# EAGLE board STBlitter_RevC2 (EAGLE 9.4.2)
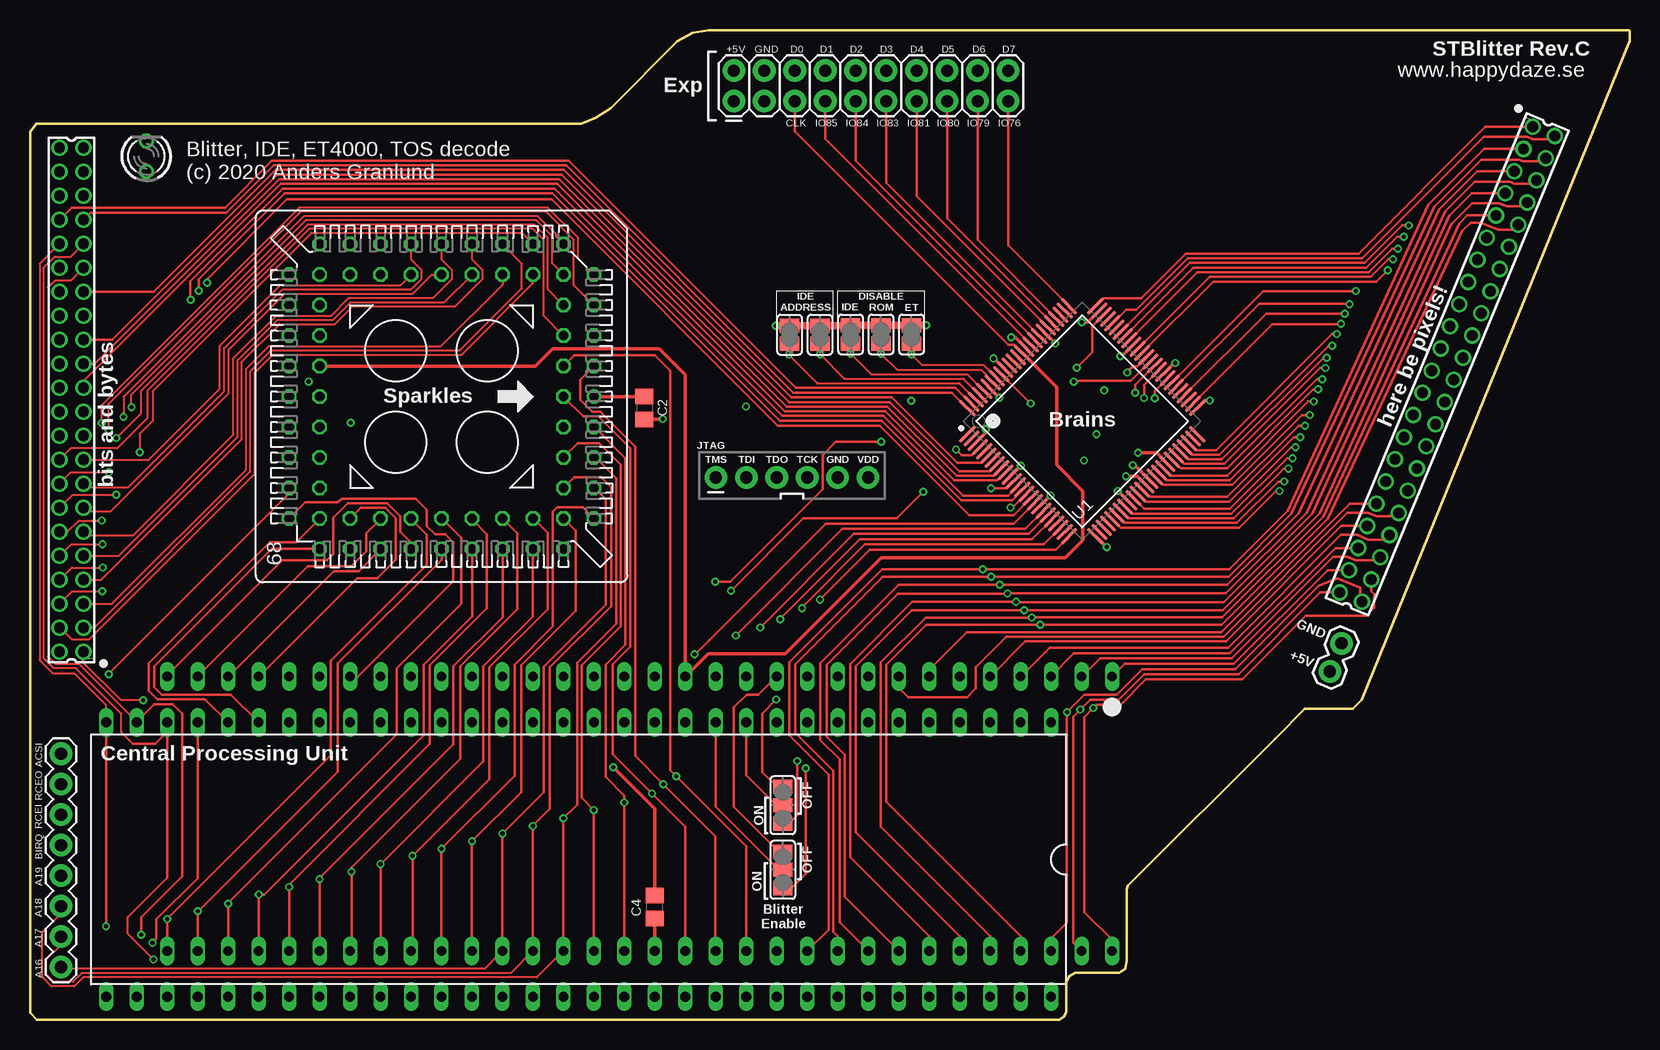
[diagram p2: board, top side]
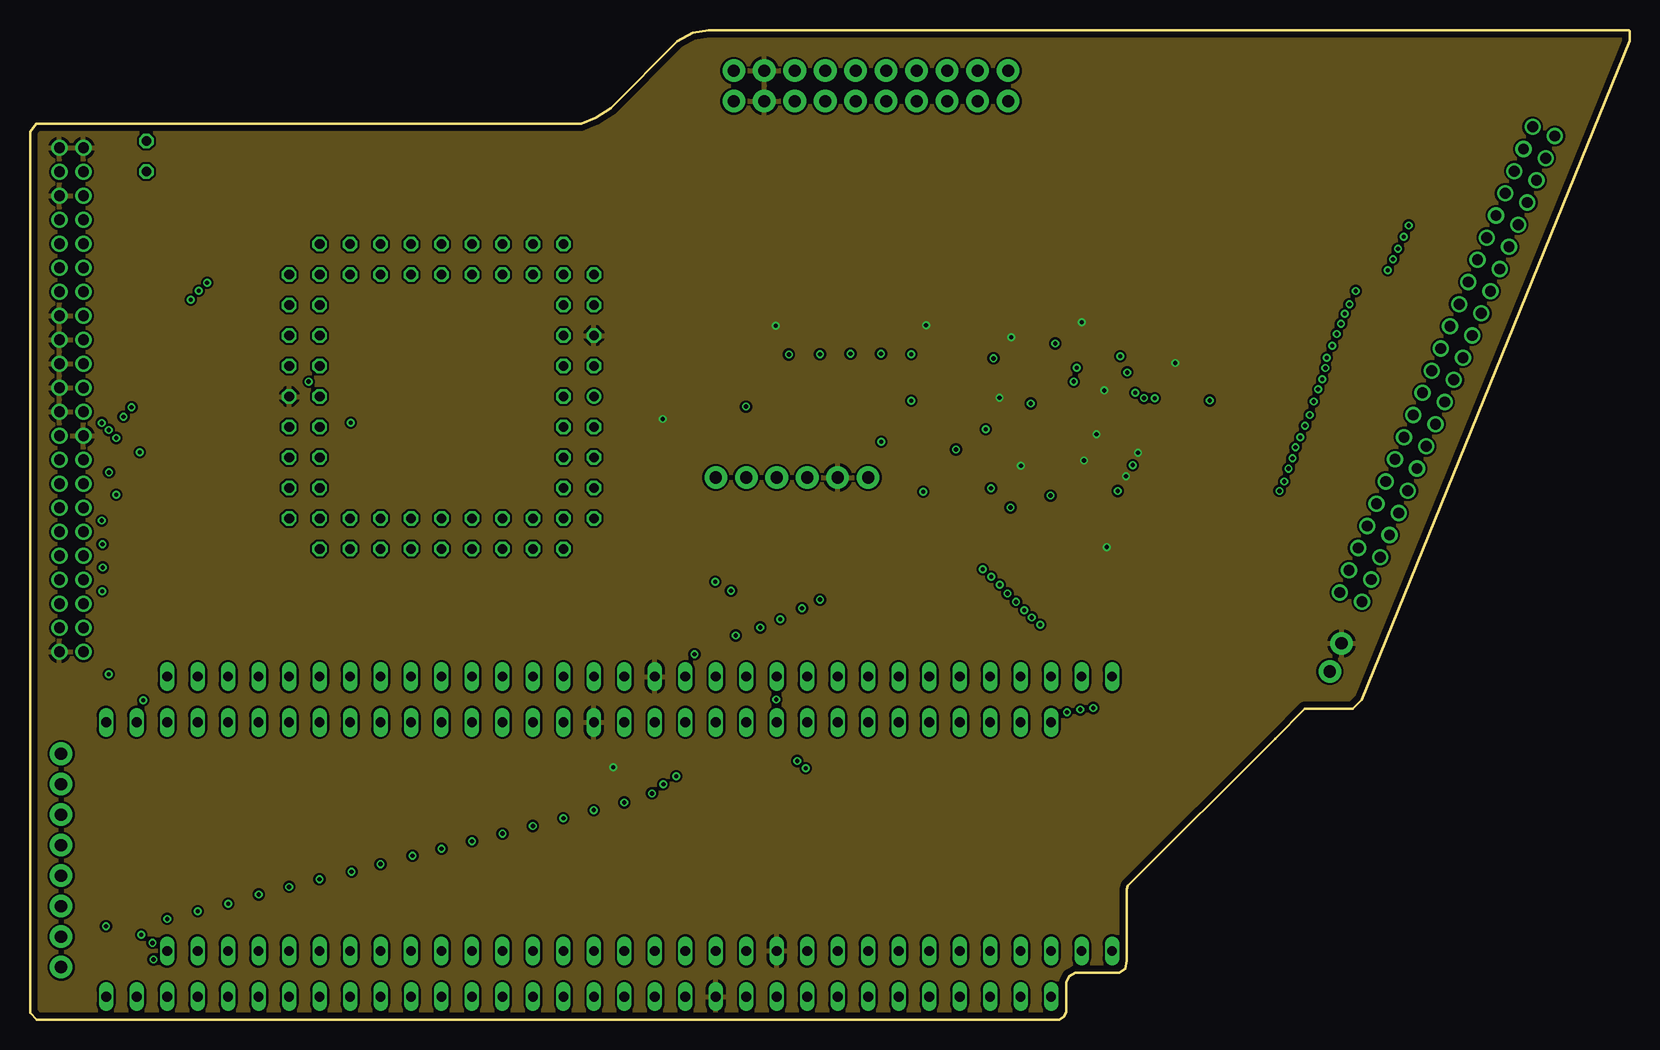
[diagram p3: board, inner layer Route2]
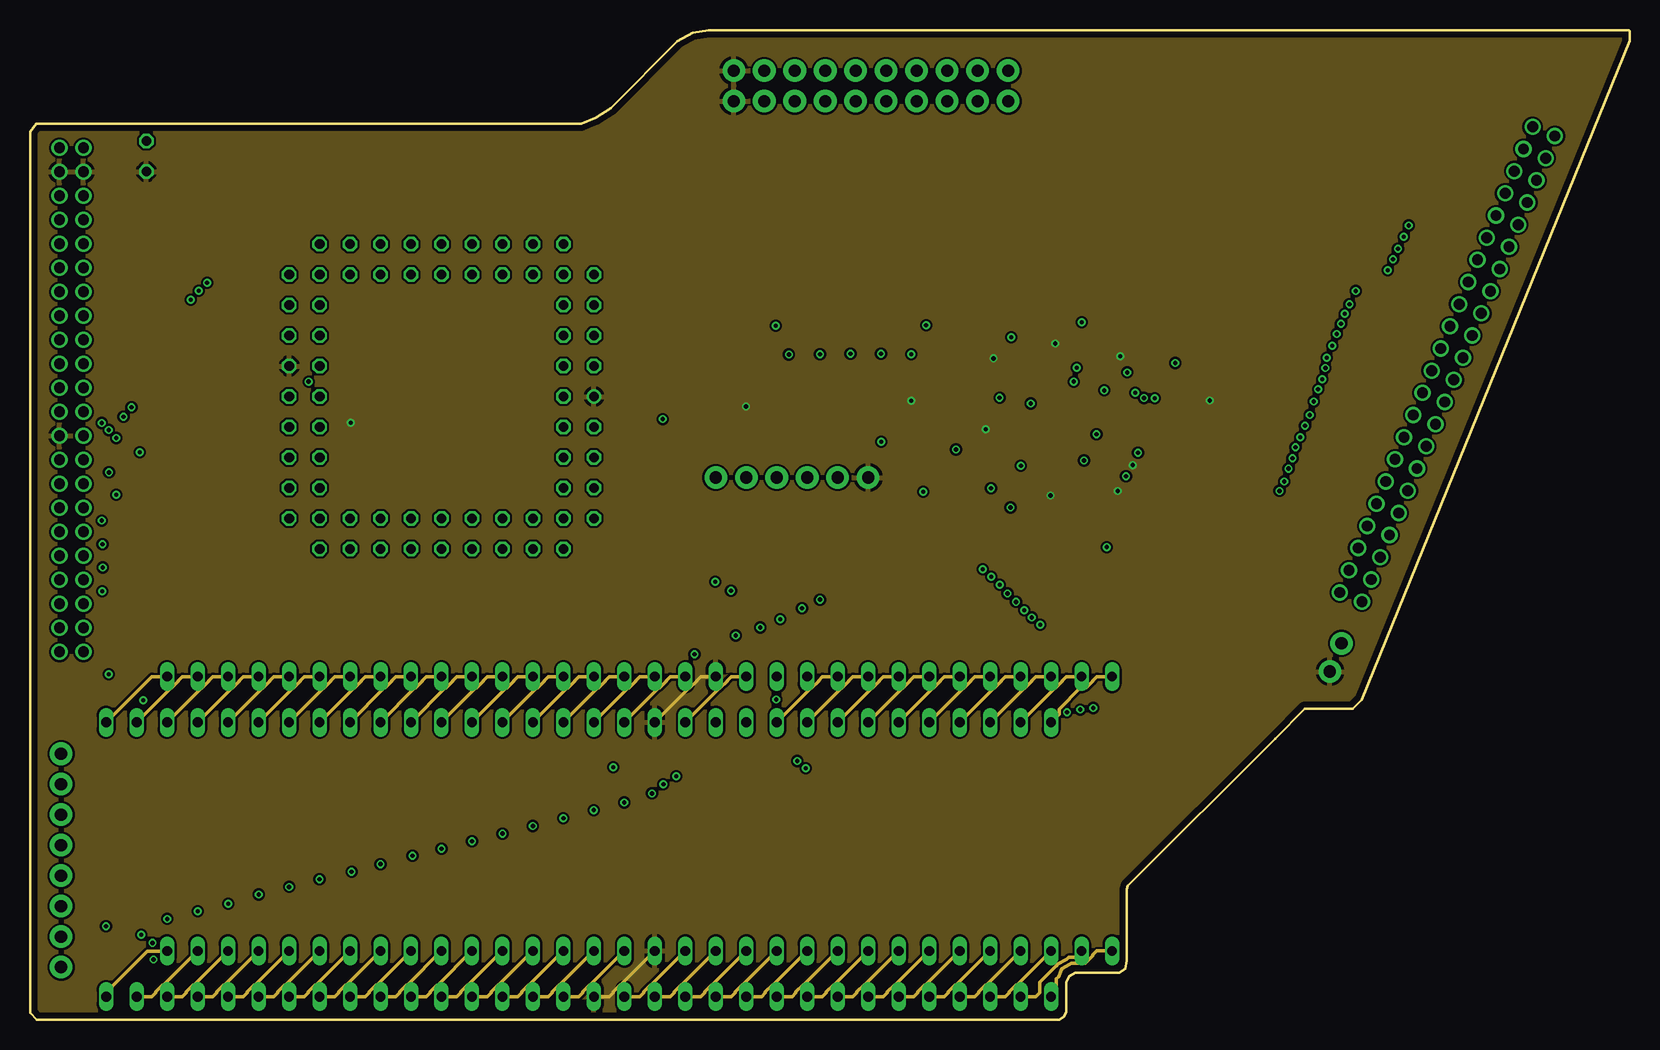
[diagram p4: board, inner layer Route15]
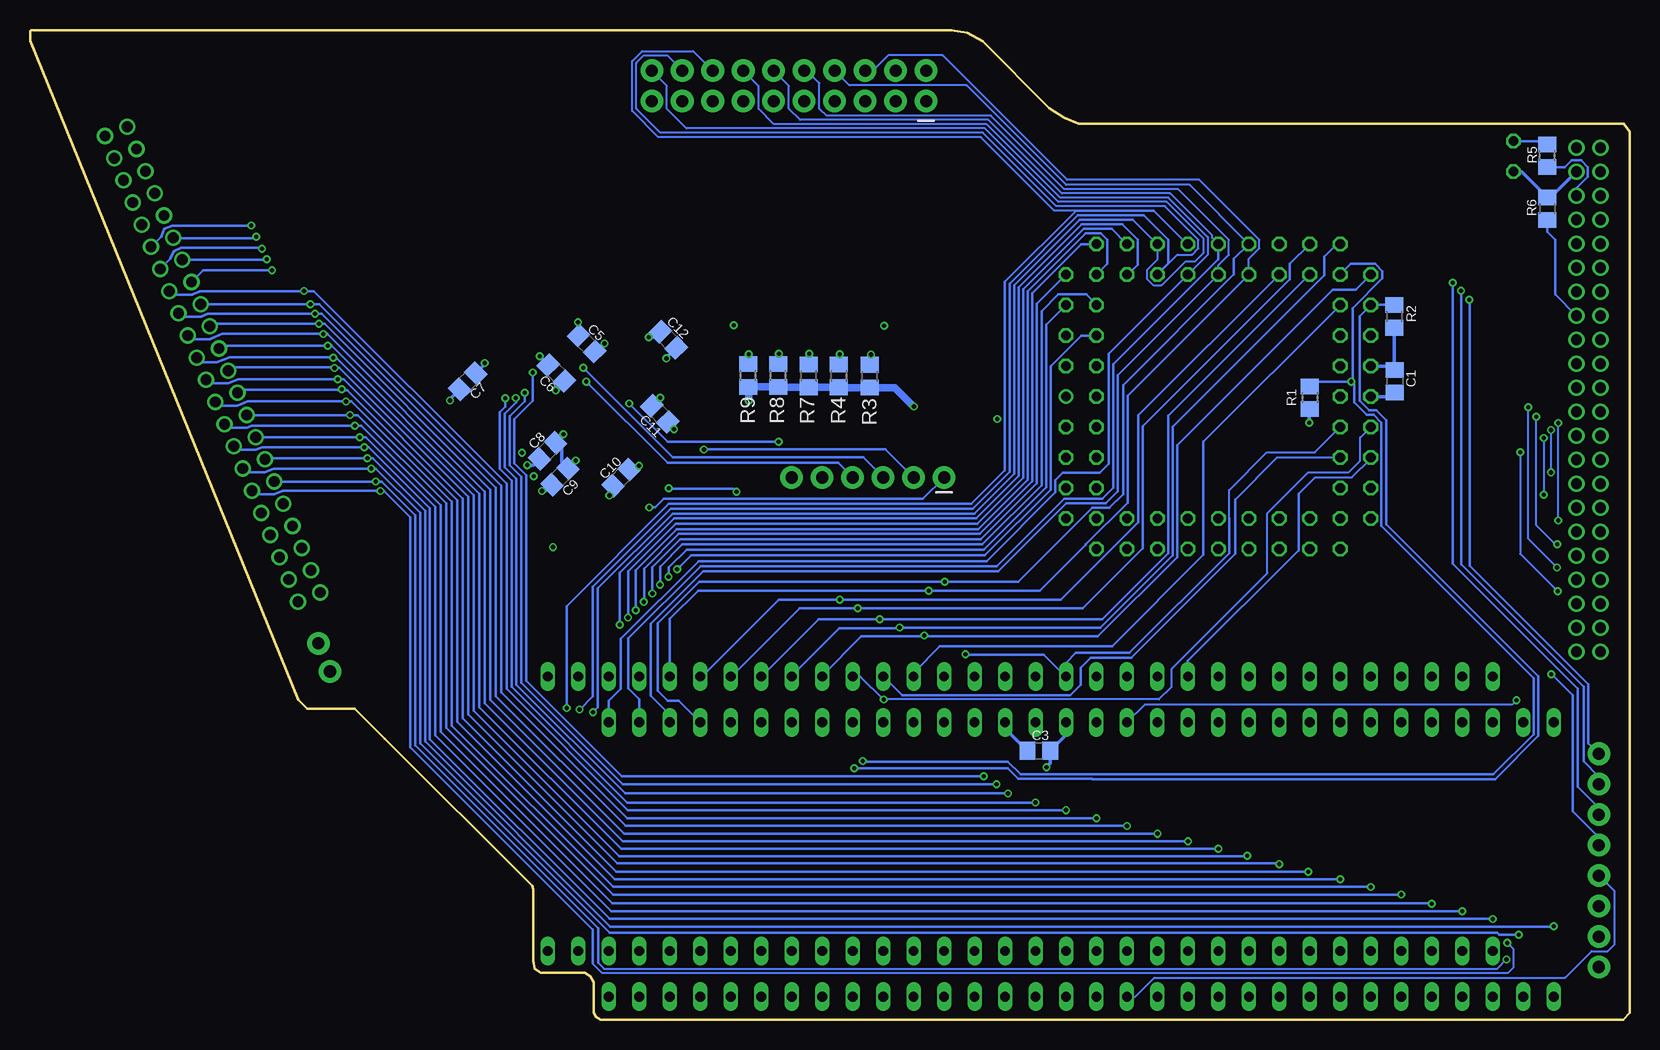
[diagram p5: board, bottom side, seen from below]

Size 133.32 x 82.46 mm. Coordinates in mm from the lower left corner, seen from the top.
Outline: 133.32,81.56 133.32,82.35 133.21,82.46 56.57,82.46 55.24,82.22 53.95,81.54 48.39,75.93 47.15,75.13 45.93,74.63 0.52,74.63 0,73.96 0,0.56 0.56,0 85.75,0 86.16,0.23 86.36,0.59 86.36,3.11 86.62,3.61 87.09,3.89 90.78,3.89 91.28,4.25 91.39,4.89 91.39,10.87 91.49,11.14 103.77,23.41 106.24,25.88 110.24,25.88 110.97,26.63 133.32,81.56
Copper layers (1*2*15*16): Top 0.035mm / dielectric 0.2mm / Route2 0.035mm / dielectric 1.2mm / Route15 0.035mm / dielectric 0.2mm / Bottom 0.035mm
Design rules "Elecrow_4-layer_PCB_eagle_rule *": minimum track width 6mil, minimum drill 12mil, track to track 7mil, track to pad 7mil, pad to pad 7mil, via to via 7mil, smd to smd 0mil, copper to edge 20mil, drill to drill 10mil, minimum pad ring 6mil, minimum via ring 6mil, stop-mask expansion 0mil, vias tented up to drill 100mil, thermal gap 10mil
Net classes: 0 default: width 0.178 mm; 1 PWR: width 0.305 mm; 2 GND: width 0.305 mm

## Footprints (pad centres in the part's own frame; a part is rotated, then mirrored left to right if it is on the bottom)
DIL64 = drill 0.813 long: 1 -39.37,-11.43; 2 -36.83,-11.43; 3 -34.29,-11.43; 4 -31.75,-11.43; 5 -29.21,-11.43; 6 -26.67,-11.43; 7 -24.13,-11.43; 8 -21.59,-11.43; 9 -19.05,-11.43; 10 -16.51,-11.43; 11 -13.97,-11.43; 12 -11.43,-11.43; 13 -8.89,-11.43; 14 -6.35,-11.43; 15 -3.81,-11.43; 16 -1.27,-11.43; 17 1.27,-11.43; 18 3.81,-11.43; 19 6.35,-11.43; 20 8.89,-11.43; 21 11.43,-11.43; 22 13.97,-11.43; 23 16.51,-11.43; 24 19.05,-11.43; 25 21.59,-11.43; 26 24.13,-11.43; 27 26.67,-11.43; 28 29.21,-11.43; 29 31.75,-11.43; 30 34.29,-11.43; 31 36.83,-11.43; 32 39.37,-11.43; 33 39.37,11.43; 34 36.83,11.43; 35 34.29,11.43; 36 31.75,11.43; 37 29.21,11.43; 38 26.67,11.43; 39 24.13,11.43; 40 21.59,11.43; 41 19.05,11.43; 42 16.51,11.43; 43 13.97,11.43; 44 11.43,11.43; 45 8.89,11.43; 46 6.35,11.43; 47 3.81,11.43; 48 1.27,11.43; 49 -1.27,11.43; 50 -3.81,11.43; 51 -6.35,11.43; 52 -8.89,11.43; 53 -11.43,11.43; 54 -13.97,11.43; 55 -16.51,11.43; 56 -19.05,11.43; 57 -21.59,11.43; 58 -24.13,11.43; 59 -26.67,11.43; 60 -29.21,11.43; 61 -31.75,11.43; 62 -34.29,11.43; 63 -36.83,11.43; 64 -39.37,11.43
PLCC68-S = drill 0.813: 1 0,12.7 | drill 0.813 octagon: 2 0,10.16; 3 -2.54,12.7; 4 -2.54,10.16; 5 -5.08,12.7; 6 -5.08,10.16; 7 -7.62,12.7; 8 -7.62,10.16; 9 -10.16,12.7; 10 -12.7,10.16; 11 -10.16,10.16; 12 -12.7,7.62; 13 -10.16,7.62; 14 -12.7,5.08; 15 -10.16,5.08; 16 -12.7,2.54; 17 -10.16,2.54; 18 -12.7,0; 19 -10.16,0; 20 -12.7,-2.54; 21 -10.16,-2.54; 22 -12.7,-5.08; 23 -10.16,-5.08; 24 -12.7,-7.62; 25 -10.16,-7.62; 26 -12.7,-10.16; 27 -10.16,-12.7; 28 -10.16,-10.16; 29 -7.62,-12.7; 30 -7.62,-10.16; 31 -5.08,-12.7; 32 -5.08,-10.16; 33 -2.54,-12.7; 34 -2.54,-10.16; 35 0,-12.7; 36 0,-10.16; 37 2.54,-12.7; 38 2.54,-10.16; 39 5.08,-12.7; 40 5.08,-10.16; 41 7.62,-12.7; 42 7.62,-10.16; 43 10.16,-12.7; 44 12.7,-10.16; 45 10.16,-10.16; 46 12.7,-7.62; 47 10.16,-7.62; 48 12.7,-5.08; 49 10.16,-5.08; 50 12.7,-2.54; 51 10.16,-2.54; 52 12.7,0; 53 10.16,0; 54 12.7,2.54; 55 10.16,2.54; 56 12.7,5.08; 57 10.16,5.08; 58 12.7,7.62; 59 10.16,7.62; 60 12.7,10.16; 61 10.16,12.7; 62 10.16,10.16; 63 7.62,12.7; 64 7.62,10.16; 65 5.08,12.7; 66 5.08,10.16; 67 2.54,12.7; 68 2.54,10.16
C0805 = smd 1.3 x 1.5: 1 -0.95,0; 2 0.95,0
IDE44_CON = drill 0.9 pad 1.27: 1 -21,-1; 2 -21,1; 3 -19,-1; 4 -19,1; 5 -17,-1; 6 -17,1; 7 -15,-1; 8 -15,1; 9 -13,-1; 10 -13,1; 11 -11,-1; 12 -11,1; 13 -9,-1; 14 -9,1; 15 -7,-1; 16 -7,1; 17 -5,-1; 18 -5,1; 19 -3,-1; 20 -3,1; 21 -1,-1; 22 -1,1; 23 1,-1; 24 1,1; 25 3,-1; 26 3,1; 27 5,-1; 28 5,1; 29 7,-1; 30 7,1; 31 9,-1; 32 9,1; 33 11,-1; 34 11,1; 35 13,-1; 36 13,1; 37 15,-1; 38 15,1; 39 17,-1; 40 17,1; 41 19,-1; 42 19,1; 43 21,-1; 44 21,1
DIL64_SOCKET = drill 0.813 long: 1 -39.37,-11.43; 2 -36.83,-11.43; 3 -34.29,-11.43; 4 -31.75,-11.43; 5 -29.21,-11.43; 6 -26.67,-11.43; 7 -24.13,-11.43; 8 -21.59,-11.43; 9 -19.05,-11.43; 10 -16.51,-11.43; 11 -13.97,-11.43; 12 -11.43,-11.43; 13 -8.89,-11.43; 14 -6.35,-11.43; 15 -3.81,-11.43; 16 -1.27,-11.43; 17 1.27,-11.43; 18 3.81,-11.43; 19 6.35,-11.43; 20 8.89,-11.43; 21 11.43,-11.43; 22 13.97,-11.43; 23 16.51,-11.43; 24 19.05,-11.43; 25 21.59,-11.43; 26 24.13,-11.43; 27 26.67,-11.43; 28 29.21,-11.43; 29 31.75,-11.43; 30 34.29,-11.43; 31 36.83,-11.43; 32 39.37,-11.43; 33 39.37,11.43; 34 36.83,11.43; 35 34.29,11.43; 36 31.75,11.43; 37 29.21,11.43; 38 26.67,11.43; 39 24.13,11.43; 40 21.59,11.43; 41 19.05,11.43; 42 16.51,11.43; 43 13.97,11.43; 44 11.43,11.43; 45 8.89,11.43; 46 6.35,11.43; 47 3.81,11.43; 48 1.27,11.43; 49 -1.27,11.43; 50 -3.81,11.43; 51 -6.35,11.43; 52 -8.89,11.43; 53 -11.43,11.43; 54 -13.97,11.43; 55 -16.51,11.43; 56 -19.05,11.43; 57 -21.59,11.43; 58 -24.13,11.43; 59 -26.67,11.43; 60 -29.21,11.43; 61 -31.75,11.43; 62 -34.29,11.43; 63 -36.83,11.43; 64 -39.37,11.43
1X08 = drill 1.016 pad 1.88: 1 0,0; 2 2.54,0; 3 5.08,0; 4 7.62,0; 5 10.16,0; 6 12.7,0; 7 15.24,0; 8 17.78,0
2X10 = drill 1.016 pad 1.88: 1 0,0; 2 0,2.54; 3 2.54,0; 4 2.54,2.54; 5 5.08,0; 6 5.08,2.54; 7 7.62,0; 8 7.62,2.54; 9 10.16,0; 10 10.16,2.54; 11 12.7,0; 12 12.7,2.54; 13 15.24,0; 14 15.24,2.54; 15 17.78,0; 16 17.78,2.54; 17 20.32,0; 18 20.32,2.54; 19 22.86,0; 20 22.86,2.54
JTAG_ATDH2 = drill 1.016 pad 1.88: 1 -1.27,5.08; 2 -1.27,2.54; 3 -1.27,0; 4 -1.27,-2.54; 5 -1.27,-5.08; 6 -1.27,-7.62
LED3MM = drill 0.813 octagon: A -1.27,0; K 1.27,0
1X02 = drill 1.016 pad 1.88: 1 0,0; 2 2.54,0
R0805 = smd 1.3 x 1.5: 1 -0.95,0; 2 0.95,0
SJ_2 = smd 1.168 x 1.6: 1 -1.524,0; 2 0,0; 3 1.524,0
SJ = smd 1.168 x 1.6: 1 -0.762,0; 2 0.762,0
STGACON = drill 0.9 pad 1.27: 1 -21,-1; 2 -21,1; 3 -19,-1; 4 -19,1; 5 -17,-1; 6 -17,1; 7 -15,-1; 8 -15,1; 9 -13,-1; 10 -13,1; 11 -11,-1; 12 -11,1; 13 -9,-1; 14 -9,1; 15 -7,-1; 16 -7,1; 17 -5,-1; 18 -5,1; 19 -3,-1; 20 -3,1; 21 -1,-1; 22 -1,1; 23 1,-1; 24 1,1; 25 3,-1; 26 3,1; 27 5,-1; 28 5,1; 29 7,-1; 30 7,1; 31 9,-1; 32 9,1; 33 11,-1; 34 11,1; 35 13,-1; 36 13,1; 37 15,-1; 38 15,1; 39 17,-1; 40 17,1; 41 19,-1; 42 19,1; 43 21,-1; 44 21,1
MICROCHIP_-_ATMEL_ATF1504ASV-15AC100_1 = smd 1.8 x 0.3: 1 -7.55,6; 2 -7.55,5.5; 3 -7.55,5; 4 -7.55,4.5; 5 -7.55,4; 6 -7.55,3.5; 7 -7.55,3; 8 -7.55,2.5; 9 -7.55,2; 10 -7.55,1.5; 11 -7.55,1; 12 -7.55,0.5; 13 -7.55,0; 14 -7.55,-0.5; 15 -7.55,-1; 16 -7.55,-1.5; 17 -7.55,-2; 18 -7.55,-2.5; 19 -7.55,-3; 20 -7.55,-3.5; 21 -7.55,-4; 22 -7.55,-4.5; 23 -7.55,-5; 24 -7.55,-5.5; 25 -7.55,-6; 51 7.55,-6; 52 7.55,-5.5; 53 7.55,-5; 54 7.55,-4.5; 55 7.55,-4; 56 7.55,-3.5; 57 7.55,-3; 58 7.55,-2.5; 59 7.55,-2; 60 7.55,-1.5; 61 7.55,-1; 62 7.55,-0.5; 63 7.55,0; 64 7.55,0.5; 65 7.55,1; 66 7.55,1.5; 67 7.55,2; 68 7.55,2.5; 69 7.55,3; 70 7.55,3.5; 71 7.55,4; 72 7.55,4.5; 73 7.55,5; 74 7.55,5.5; 75 7.55,6 | smd 0.3 x 1.8: 26 -6,-7.55; 27 -5.5,-7.55; 28 -5,-7.55; 29 -4.5,-7.55; 30 -4,-7.55; 31 -3.5,-7.55; 32 -3,-7.55; 33 -2.5,-7.55; 34 -2,-7.55; 35 -1.5,-7.55; 36 -1,-7.55; 37 -0.5,-7.55; 38 0,-7.55; 39 0.5,-7.55; 40 1,-7.55; 41 1.5,-7.55; 42 2,-7.55; 43 2.5,-7.55; 44 3,-7.55; 45 3.5,-7.55; 46 4,-7.55; 47 4.5,-7.55; 48 5,-7.55; 49 5.5,-7.55; 50 6,-7.55; 76 6,7.55; 77 5.5,7.55; 78 5,7.55; 79 4.5,7.55; 80 4,7.55; 81 3.5,7.55; 82 3,7.55; 83 2.5,7.55; 84 2,7.55; 85 1.5,7.55; 86 1,7.55; 87 0.5,7.55; 88 0,7.55; 89 -0.5,7.55; 90 -1,7.55; 91 -1.5,7.55; 92 -2,7.55; 93 -2.5,7.55; 94 -3,7.55; 95 -3.5,7.55; 96 -4,7.55; 97 -4.5,7.55; 98 -5,7.55; 99 -5.5,7.55; 100 -6,7.55

## Placement (x,y rotation side)
68000  [DIL64]  45.72,13.34 180 top
BLITTER  STBLITTER  [PLCC68-S]  34.3,51.92 270 top
C1  0.1uF  [C0805]  19.61,53.19 270 bottom
C2  0.1uF  [C0805]  51.21,50.95 270 top
C3  0.1uF  [C0805]  49.25,22.4 0 bottom
C4  0.1uF  [C0805]  52.07,9.37 90 top
C5  0.1uF  [C0805]  86.94,56.34 315 bottom
C6  0.1uF  [C0805]  89.46,53.87 135 bottom
C7  0.1uF  [C0805]  96.85,53.19 225 bottom
C8  0.1uF  [C0805]  90.2,47.4 225 bottom
C9  0.1uF  [C0805]  89.15,45.24 225 bottom
C10  0.1uF  [C0805]  84.07,45.16 225 bottom
C11  0.1uF  [C0805]  80.85,50.47 315 bottom
C12  0.1uF  [C0805]  80.14,56.64 315 bottom
CFCARD  IDE44_CON  [IDE44_CON]  3.45,51.64 90 top
IC1  [DIL64_SOCKET]  50.8,17.14 180 top
J1  [1X08]  2.59,4.37 90 top
J4  [2X10]  58.65,76.53 0 top
JTAG  JTAG_ATDH2  [JTAG_ATDH2]  62.23,46.43 90 top
LED1  [LED3MM]  9.7,71.93 90 top
PWR  [1X02]  109.3,31.34 247.5 top
R1  [R0805]  26.67,51.82 270 bottom
R2  [R0805]  19.63,58.6 270 bottom
R3  [R0805]  63.35,53.61 90 bottom
R4  [R0805]  65.91,53.64 90 bottom
R5  390R  [R0805]  6.88,71.98 90 bottom
R6  100R  [R0805]  6.88,67.56 270 bottom
R7  [R0805]  68.43,53.64 90 bottom
R8  [R0805]  70.97,53.66 90 bottom
R9  [R0805]  73.48,53.66 90 bottom
SJ1  [SJ_2]  62.74,17.86 90 top
SJ2  [SJ_2]  62.74,12.47 90 top
SJ3  [SJ]  63.29,57.06 270 top
SJ4  [SJ]  65.84,57.06 270 top
SJ5  [SJ]  68.38,57.09 270 top
SJ6  [SJ]  70.92,57.09 270 top
SJ7  [SJ]  73.45,57.09 270 top
STGA  STGA  [STGACON]  118.11,54.61 247.5 top
U1  ATF1504_SMD100MICROCHIP_-_ATMEL_ATF1504ASV-15AC100_0_1  [MICROCHIP_-_ATMEL_ATF1504ASV-15AC100_1]  87.68,49.86 45 top

## Tracks (layer width: path | path; a pad name or v marks a point on that pad's centre or on a via)
+5V  (via drill 0.35)
  Top 0.305: IC1.49 C4.1 | U1.91 80.33,55.09 v80.29,55.09 | U1.3 79.65,48.91 v79.65,49.2 | U1.18 85.02,43.66 v85.04,43.66 | U1.34 91.59,43.11 v90.65,44.04 | v91.9,46.2 92.05,46.2 U1.39 | U1.51 97.89,51.59 v98.32,51.59 | U1.82 v85.45,56.34 | U1.66 90.97,55.27 v90.86,55.27 | BLITTER.1 C2.1
  Route15 0.305: 68000.49 48.26,1.91 48.59,2.24 48.59,2.29 49.14,2.84 49.2,2.84 IC1.49 | IC1.14 55.88,28.57 55.55,28.25 55.55,28.19 55,27.64 54.94,27.64 68000.14
  Bottom 0.305: C3.1 52.04,24.25 52.04,24.79 68000.14 | CFCARD.41 6.58,68.51 R6.1 9.03,70.66 LED1.A | C5.2 86.12,55.66 v85.45,56.34 | C7.2 98.32,51.71 v98.32,51.59 | v91.9,46.2 91.39,46.2 C8.2 | v90.65,44.04 90.35,44.04 C9.2 | v85.04,43.66 85.04,44.2 C10.2 | v80.29,55.09 80.29,55.15 C12.2 | v79.65,49.2 80.18,49.72 C11.2 | v90.86,55.27 | v90.86,55.27 C6.2 | BLITTER.33 19.93,54.46 C1.1 19.63,54.16 R2.2 | R1.2 26.72,50.91 v26.72,49.73
  Bottom 0.61: v73.43,51.56 73.43,52.66 R9.1 R8.1 70.94,52.69 R7.1 R4.1 65.89,52.66 R3.1 61.24,52.66 v59.66,51.08
  pour Route15: -13.77,86.46 143.81,86.46 143.81,-9.25 -13.77,-9.25
_BGACK  (via drill 0.35)
  Top 0.203: v64.64,20.93 64.64,12.14 63.45,10.95 SJ2.1
  Bottom 0.203: v64.64,20.93 51.85,20.93 50.96,20.04 44.81,20.04 11.21,20.04 7.62,23.63 7.62,28.61 20.3,41.28 20.3,49.95 21.12,50.77 21.74,50.77 22.51,51.55 22.51,58.62 BLITTER.29 21.59,59.55 R2.1
A1  (via drill 0.35)
  Top 0.178: 10.54,6.82 10.54,6.72 v10.21,6.39
  Top 0.203: v104.12,44.05 103.85,44.05 100.78,40.98 90.91,40.98 U1.30 | IC1.29 27.25,36.78 28.93,36.78 30.48,38.33 30.48,41.78 29.62,42.65 27.57,42.65 BLITTER.47 | 68000.29 13.97,11.78 10.54,8.35 10.54,6.82
  Route15 0.305: IC1.29 17.78,28.57 17.45,28.25 17.45,28.19 16.9,27.64 16.84,27.64 68000.29
  Bottom 0.178: 86.44,4.73 86.44,4.67 85.64,3.87 10.16,3.87 9.69,4.34 9.69,5.86 v10.21,6.39
  Bottom 0.203: 104.11,44.06 112.26,44.06 112.98,43.77 114.53,43.77 STGA.34 | 86.44,4.73 86.44,7.5 101.62,22.69 101.62,41.86 103.83,44.06 104.11,44.06 | 104.11,44.06 v104.12,44.05
A2  (via drill 0.35)
  Top 0.178: 8.27,23.28 7.61,23.95 7.61,25.49 3.82,29.27 1.98,29.27 1.16,30.1 1.16,62.67 2.06,63.58 3.4,63.58 CFCARD.35 | v10.29,5 8.13,7.16 8.13,8.5
  Top 0.203: v104.52,44.83 104.01,44.83 100.57,41.39 91.21,41.39 U1.31 | 8.13,8.5 11.43,11.81 68000.30 11.43,23.98 10.44,22.99 8.56,22.99 8.27,23.28 | IC1.30 25.3,37.36 27.38,37.36 29.17,39.15 29.17,39.17 BLITTER.48
  Route15 0.305: IC1.30 15.24,28.57 14.91,28.25 14.91,28.19 14.36,27.64 14.3,27.64 68000.30
  Bottom 0.178: 85.98,4.73 85.48,4.23 11.07,4.23 v10.29,5
  Bottom 0.203: 85.98,4.73 85.98,7.62 101.22,22.86 101.22,42.04 104.01,44.83 v104.52,44.83 STGA.33
A3  (via drill 0.35)
  Top 0.178: CFCARD.33 3.4,61.58 2.06,61.58 1.65,61.16 1.55,61.16 1.55,61.06 1.51,61.03 1.51,30.25 2.13,29.63 4.07,29.63 8.89,24.81 68000.31
  Top 0.203: v104.88,45.91 104.47,45.91 100.32,41.77 91.53,41.77 U1.32 | IC1.31 13.97,28.6 23.14,37.77 26.77,37.77 28.02,39.01 28.02,40.51 29.22,41.71 BLITTER.49 | v9.27,7.07 9.27,8.5 12.7,11.93 12.7,25.48 11.91,26.26 10.34,26.26 8.89,24.81
  Route15 0.305: IC1.31 12.7,28.57 12.37,28.25 12.37,28.19 11.82,27.64 11.76,27.64 68000.31
  Bottom 0.203: v9.27,7.07 10.88,7.07 11.05,7.24 85.03,7.24 100.81,23.02 100.81,42.22 104.51,45.91 v104.88,45.91 113.03,45.91 113.74,45.62 115.3,45.62 STGA.32
A4  (via drill 0.35)
  Top 0.178: CFCARD.36 0.8,62.99 0.8,29.95 1.93,28.83 3.71,28.83 6.35,26.19 68000.32
  Top 0.203: v105.21,46.78 104.75,46.78 100.12,42.15 91.86,42.15 U1.33 | 68000.32 6.35,7.78 v6.34,7.77 | IC1.32 11.43,28.68 21.03,38.28 24.74,38.28 25.25,38.79 25.25,41.8 26.49,43.03 29.77,43.03 30.86,41.94 30.86,40.64 31.76,39.74 BLITTER.50
  Route15 0.305: 68000.32 10.16,28.57 IC1.32
  Bottom 0.203: v6.34,7.77 6.36,7.75 18.17,7.75 18.18,7.75 84.96,7.75 100.41,23.19 100.41,42.42 104.77,46.78 v105.21,46.78 113.64,46.78 STGA.31
A5  (via drill 0.35)
  Top 0.203: IC1.33 v11.43,8.38 25.07,22.02 25.07,29.9 33.08,37.9 33.08,40.39 31.76,41.71 BLITTER.51 | v105.46,47.69 105.09,47.69 99.98,42.57 92.85,42.57 U1.35
  Route15 0.305: 68000.33 6.35,2.26 9.78,5.69 11.41,5.69 IC1.33
  Bottom 0.203: STGA.30 116.06,47.47 114.51,47.47 113.97,47.69 v105.46,47.69 105.09,47.69 100,42.6 100,23.36 85.02,8.38 v11.43,8.38
A6  (via drill 0.35)
  Top 0.203: IC1.34 v13.97,9.02 14.01,9.02 25.65,20.66 25.65,29.68 34.3,38.32 BLITTER.52 | v105.84,48.53 105.32,48.53 99.92,43.13 93,43.13 U1.36
  Route15 0.305: 68000.34 10.16,1.91 10.49,2.24 10.49,2.29 11.04,2.84 11.1,2.84 IC1.34
  Bottom 0.203: v13.97,9.02 84.88,9.02 99.54,23.68 99.54,42.73 105.34,48.53 v105.84,48.53 STGA.29
A7  (via drill 0.35)
  Top 0.203: IC1.35 v16.51,9.65 16.51,9.72 30.55,23.76 30.55,29.26 35.92,34.63 35.92,40.15 BLITTER.53 | v106.25,49.48 105.71,49.48 99.79,43.56 93.3,43.56 92.69,44.17 U1.37
  Route15 0.305: 68000.35 12.7,1.91 13.03,2.24 13.03,2.29 13.58,2.84 13.64,2.84 IC1.35
  Bottom 0.203: v16.51,9.65 16.56,9.7 84.8,9.7 99.09,23.99 99.09,42.86 105.71,49.48 v106.25,49.48 114.86,49.48 115.27,49.31 116.83,49.31 STGA.28
A8  (via drill 0.35)
  Top 0.203: IC1.36 v19.05,10.41 19.53,10.41 32.81,23.69 32.81,29.57 36.84,33.59 BLITTER.54 | v106.66,50.37 105.99,50.37 100.18,44.57 94.39,44.57 U1.40
  Route15 0.305: 68000.36 15.24,1.91 15.57,2.24 15.57,2.29 16.12,2.84 16.18,2.84 IC1.36
  Bottom 0.203: v19.05,10.41 84.73,10.41 98.63,24.31 98.63,43 106,50.37 v106.66,50.37 STGA.27
A9  (via drill 0.35)
  Top 0.203: IC1.37 v21.59,11.05 21.59,11.23 33.32,22.97 33.32,29.53 38.08,34.29 38.08,40.45 36.84,41.69 BLITTER.55 | v106.99,51.51 106.53,51.51 99.97,44.95 94.71,44.95 U1.41
  Route15 0.305: 68000.37 17.78,1.91 18.11,2.24 18.11,2.29 18.66,2.84 18.72,2.84 IC1.37
  Bottom 0.203: STGA.26 117.59,51.16 116.04,51.16 115.2,51.51 v106.99,51.51 | v21.59,11.05 84.72,11.05 98.17,24.5 98.17,43.14 106.54,51.51 v106.99,51.51 | v106.99,51.51
A10  (via drill 0.35)
  Top 0.203: IC1.38 v24.13,11.68 24.13,11.83 35.25,22.95 35.25,29.42 39.38,33.54 BLITTER.56 | v107.34,52.53 107.29,52.48 106.91,52.48 99.76,45.33 95.04,45.33 U1.42
  Route15 0.305: 68000.38 20.32,1.91 20.65,2.24 20.65,2.29 21.2,2.84 21.26,2.84 IC1.38
  Bottom 0.203: v24.13,11.68 84.58,11.68 97.71,24.82 97.71,43.28 106.88,52.45 107.26,52.45 v107.34,52.53 107.34,52.5 115.76,52.5 STGA.25
A11  (via drill 0.35)
  Top 0.203: IC1.39 26.8,5.84 v26.8,12.32 26.8,12.7 35.84,21.75 35.84,29.45 38.75,32.37 40.6,34.21 40.6,40.53 39.38,41.74 BLITTER.57 | v107.69,53.37 107.21,53.37 99.77,45.93 95.88,45.93 95.16,46.64 U1.44
  Route15 0.305: 68000.39 22.86,1.91 23.19,2.24 23.19,2.29 23.74,2.84 23.8,2.84 IC1.39
  Bottom 0.203: v26.8,12.32 84.46,12.32 97.26,25.12 97.26,43.42 107.2,53.36 107.7,53.36 | STGA.24 118.36,53.01 116.8,53.01 115.96,53.36 107.7,53.36 | 107.7,53.36 v107.69,53.37
A12  (via drill 0.35)
  Top 0.203: IC1.40 v29.21,12.95 37.77,21.51 37.77,29.42 41.92,33.57 BLITTER.58 | v107.95,54.3 107.5,54.3 99.51,46.31 96.18,46.31 U1.45
  Route15 0.305: 68000.40 25.4,1.91 25.73,2.24 25.73,2.29 26.28,2.84 26.34,2.84 IC1.40
  Bottom 0.203: v29.21,12.95 29.34,12.95 29.39,13.01 84.38,13.01 96.8,25.43 96.8,43.56 107.54,54.3 v107.95,54.3 108.05,54.3 108.1,54.35 116.52,54.35 STGA.23
A13  (via drill 0.35)
  Top 0.203: IC1.41 31.88,5.84 v31.88,13.64 38.28,20.04 38.28,29.35 43.14,34.21 43.14,40.58 41.95,41.76 BLITTER.59 | v108.07,55.16 107.8,55.16 99.33,46.69 96.52,46.69 U1.46
  Route15 0.305: 68000.41 27.94,1.91 28.27,2.24 28.27,2.29 28.82,2.84 28.88,2.84 IC1.41
  Bottom 0.203: v31.88,13.64 31.93,13.59 84.2,13.59 96.34,25.73 96.34,43.7 107.84,55.2 108.13,55.2 | 108.13,55.2 116.68,55.2 117.75,54.75 119.02,54.75 STGA.22 | 108.13,55.2 108.09,55.16 v108.07,55.16
A14  (via drill 0.35)
  Top 0.203: IC1.42 v34.29,14.22 40.39,20.32 40.39,29.57 43.57,32.76 43.57,42.33 43.94,42.7 46.06,42.7 BLITTER.61 | v108.51,56.15 108.48,56.12 108.17,56.12 99.12,47.07 96.86,47.07 96.23,47.7 U1.47
  Route15 0.305: 68000.42 30.48,1.91 30.81,2.24 30.81,2.29 31.36,2.84 31.42,2.84 IC1.42
  Bottom 0.203: v34.29,14.22 84.07,14.22 95.89,26.04 95.89,43.83 108.2,56.15 v108.51,56.15 117.34,56.15 STGA.21
A15  (via drill 0.35)
  Top 0.203: IC1.43 v36.83,14.86 40.92,18.95 40.92,29.5 45.5,34.08 45.5,40.73 BLITTER.62 | v108.89,57.13 108.54,57.13 98.86,47.45 97.16,47.45 U1.48
  Route15 0.305: 68000.43 33.02,1.91 33.35,2.24 33.35,2.29 33.9,2.84 33.96,2.84 IC1.43
  Bottom 0.203: v36.83,14.86 83.95,14.86 95.43,26.34 95.43,44 108.56,57.13 v108.89,57.13 117.31,57.13 118.28,56.73 118.3,56.7 119.89,56.7 STGA.20
A16  (via drill 0.35)
  Top 0.178: IC1.44 37.88,4.23 2.73,4.23 J1.1
  Top 0.203: IC1.44 v39.37,15.49 42.8,18.92 42.8,29.4 47.96,34.56 47.96,43.37 47.03,44.3 BLITTER.63 | v109.25,57.97 109.2,57.92 103.52,57.92 U1.52
  Route15 0.305: 68000.44 35.56,1.91 35.89,2.24 35.89,2.29 36.44,2.84 36.5,2.84 IC1.44
  Bottom 0.203: v39.37,15.49 83.82,15.49 94.97,26.64 94.97,44.16 108.78,57.97 v109.25,57.97 118.13,57.97 STGA.19
A17  (via drill 0.35)
  Top 0.178: IC1.45 40.07,3.87 4.31,3.87 3.57,3.14 1.99,3.14 1.36,3.77 1.36,5.02 2.59,6.25 J1.2
  Top 0.203: IC1.45 v41.91,16.13 43.33,17.55 43.33,29.34 48.42,34.43 48.42,44.36 47.59,45.19 45.34,45.19 BLITTER.64 | v109.57,58.82 103.01,58.82 U1.54
  Route15 0.305: 68000.45 38.1,1.91 38.43,2.24 38.43,2.29 38.98,2.84 39.04,2.84 IC1.45
  Bottom 0.203: v41.91,16.13 83.69,16.13 94.51,26.95 94.51,44.3 109.02,58.8 109.55,58.8 | STGA.18 120.65,58.55 119.1,58.55 118.5,58.8 109.55,58.8 | 109.55,58.8 v109.57,58.82
A18  (via drill 0.35)
  Top 0.178: IC1.46 42.24,3.5 4.44,3.5 3.69,2.76 1.79,2.76 1,3.54 1,7.28 2.59,8.87 J1.3
  Top 0.203: IC1.46 v44.45,16.76 45.59,17.91 45.59,29.73 48.84,32.98 48.84,45.09 47.1,46.84 BLITTER.65 | v109.96,59.61 109.91,59.66 102.44,59.66 U1.56
  Route15 0.305: 68000.46 40.64,1.91 40.97,2.24 40.97,2.29 41.52,2.84 41.58,2.84 IC1.46
  Bottom 0.203: v44.45,16.76 83.57,16.76 94.06,27.25 94.06,44.46 109.21,59.61 v109.96,59.61 STGA.17
A19  (via drill 0.35)
  Top 0.203: IC1.47 v46.99,17.45 45.97,18.47 45.97,29.52 49.23,32.78 49.23,46.24 47.44,48.03 45.65,48.03 BLITTER.66 | U1.57 102.77,60.71 v110.49,60.71
  Route15 0.305: 68000.47 43.18,1.91 43.51,2.24 43.51,2.29 44.06,2.84 44.12,2.84 IC1.47
  Bottom 0.178: 68000.47 41.22,1.91 39.63,3.5 5.4,3.5 3.19,5.7 1.86,5.7 1.28,6.28 1.28,10.68 J1.4
  Bottom 0.203: v46.99,17.45 83.49,17.45 93.6,27.56 93.6,44.63 109.68,60.71 v110.49,60.71 119.12,60.71 119.87,60.4 121.42,60.4 STGA.16
A20  (via drill 0.35)
  Top 0.203: IC1.48 v49.53,18.09 49.53,18.66 47.96,20.23 47.96,29.57 49.61,31.22 49.61,46.78 47.01,49.38 BLITTER.67 | v93.72,51.76 93.72,52.37 U1.58
  Route15 0.305: 68000.48 45.72,1.91 46.05,2.24 46.05,2.29 46.6,2.84 46.66,2.84 IC1.48
  Bottom 0.203: v93.72,51.76 93.72,51.05 94.18,50.59 94.18,45.9 93.19,44.91 93.19,27.73 83.55,18.09 v49.53,18.09
A21  (via drill 0.35)
  Top 0.203: IC1.50 54.61,16.06 v51.83,18.84 48.57,22.1 48.57,29.62 50.02,31.06 50.02,47.61 47.36,50.27 46.11,50.27 BLITTER.2 | v92.84,51.79 92.84,52.9 U1.60
  Route15 0.305: 68000.50 50.8,1.91 51.13,2.24 51.13,2.29 51.68,2.84 51.74,2.84 IC1.50
  Bottom 0.203: v51.83,18.84 83.73,18.84 92.79,27.9 92.79,45.05 93.75,46.01 93.75,50.47 92.79,51.44 92.79,51.74 v92.84,51.79
A22  (via drill 0.35)
  Top 0.203: IC1.51 57.1,5.77 57.1,15.29 v52.78,19.61 50.42,21.97 50.42,47.75 47.52,50.65 46.86,50.65 45.87,51.64 45.87,53.33 BLITTER.3 | v92.1,52.22 92.1,52.88 93.71,54.49 U1.61
  Route15 0.305: 68000.51 53.34,1.91 53.67,2.24 53.67,2.29 54.22,2.84 54.28,2.84 IC1.51
  Bottom 0.203: v52.78,19.61 83.92,19.61 92.38,28.06 92.38,45.22 93.34,46.19 93.34,50.26 92.1,51.51 v92.1,52.22
A23  (via drill 0.35)
  Top 0.203: IC1.52 59.69,14.43 v53.86,20.27 53.34,20.78 53.34,54.08 52.08,55.35 45.36,55.35 BLITTER.4 | v91.44,53.92 91.62,54.1 91.62,54.13 91.93,54.44 92.26,54.44 U1.63
  Route15 0.305: 68000.52 55.88,1.91 56.21,2.24 56.21,2.29 56.76,2.84 56.82,2.84 IC1.52
  Bottom 0.203: v53.86,20.27 84.01,20.27 91.97,28.23 91.97,45.37 92.96,46.36 92.96,50.04 91.44,51.56 v91.44,53.92
ACSI10  (via drill 0.35)
  Top 0.178: v13.39,59.97 13.36,59.99
  Top 0.203: U1.13 82.34,44.49 81.51,43.66 77.75,43.66 71.12,50.29 62.69,50.29 43.73,69.25 21.07,69.25 13.36,61.54 13.36,59.99
  Bottom 0.203: J1.8 3.45,23.01 3.45,27.94 13.34,37.81 13.34,59.92 v13.39,59.97
AS  (via drill 0.35)
  Top 0.203: v65.84,34.99 65.93,35.09 65.93,35.12 69.97,39.16 85.47,39.16 U1.25
  Route15 0.305: IC1.6 76.2,28.57 75.87,28.25 75.87,28.19 75.32,27.64 75.26,27.64 68000.6
  Bottom 0.203: IC1.6 77.36,28.57 70.94,34.99 v65.84,34.99 47.42,34.99 40.97,41.45 40.97,50.34 BLITTER.23
BERR
  Route15 0.305: IC1.22 35.56,28.57 35.23,28.25 35.23,28.19 34.68,27.64 34.62,27.64 68000.22
  Bottom 0.178: BLITTER.39 21.6,46.74 23.16,45.17 26.23,45.17 27.59,43.81
  Bottom 0.203: IC1.22 36.83,29.88 27.59,39.12 27.59,43.81
BG
  Top 0.203: SJ1.2 62.18,17.86 59.69,20.35 68000.11
BGACK
  Top 0.203: SJ2.2 62.41,12.47 57.15,17.73 68000.12
BGKI
  Top 0.203: IC1.12 62.18,28.57 60.68,27.08 59.71,27.08 58.65,26.01 58.65,17.73 62.38,14 SJ2.3
  Bottom 0.178: 32.9,43.33 29.39,46.84 BLITTER.40
  Bottom 0.203: IC1.12 62.18,28.57 60.64,27.04 46.62,27.04 45.77,27.89 45.77,29.31 44.92,30.16 41.55,30.16 32.9,38.82 32.9,43.33
BGO  (via drill 0.35)
  Top 0.203: v62.18,26.67 61.01,25.5 61.01,20.62 62.25,19.38 SJ1.3
  Bottom 0.178: BLITTER.37 22.48,48.49 22.48,46.58 23.45,45.61 26.81,45.61 30.22,42.2 30.22,37.19 38.19,29.22 38.19,27.73 39.25,26.67 v62.18,26.67
  Bottom 0.203: IC1.11 64.14,28.57 62.23,26.67 v62.18,26.67
BIRQ  (via drill 0.35)
  Top 0.203: BLITTER.41 21.6,43.87 6.55,28.82 v6.55,28.78
  Bottom 0.203: J1.5 2.59,15.19 4.78,17.37 4.78,27.03 6.53,28.78 v6.55,28.78
BLTBGI  (via drill 0.35)
  Top 0.203: v63.93,21.54 63.93,17.02 63.25,16.33 SJ1.1
  Bottom 0.203: v63.93,21.54 63.88,21.49 51.84,21.49 50.78,20.42 44.66,20.42 44.65,20.42 11.37,20.42 8,23.79 8,28.45 20.71,41.15 20.71,49.75 21.36,50.39 21.92,50.39 22.97,51.44 22.97,52.84 23.22,53.09 v23.22,53.16 | BLITTER.28 23.26,62.97 21.23,62.97 20.64,62.38 20.64,61.75 23.11,59.28 23.11,53.39 23.22,53.29 v23.22,53.16 | R1.1 26.27,53.16 v23.22,53.16
BR
  Route15 0.305: IC1.13 58.42,28.57 58.09,28.25 58.09,28.19 57.54,27.64 57.48,27.64 68000.13
  Bottom 0.178: 35.53,48.16 24.16,59.54 BLITTER.30
  Bottom 0.203: IC1.13 59.69,28.92 57.51,31.1 43.16,31.1 35.53,38.72 35.53,48.16
CLK
  Top 0.203: U1.87 82.01,56.24 81.51,56.24 63.73,74.02 J4.5
  Top 0.305: U1.87 85.55,52.7 85.55,46.21 87.75,44.01 87.75,39.95 86.27,38.48 70.95,38.48 62.96,30.48 56.51,30.48 IC1.15 54.61,53.74 52.45,55.91 43.57,55.91 42.12,54.46 BLITTER.34
  Route15 0.305: IC1.15 53.34,28.57 53.01,28.25 53.01,28.19 52.46,27.64 52.4,27.64 68000.15
D0  (via drill 0.35)
  Top 0.178: CFCARD.17 9.89,46.64 15.78,52.53 15.78,56.09 20.91,61.21 21.22,61.21 21.23,61.2 30.88,61.2 BLITTER.21
  Top 0.203: STGA.37 109.28,41.13 99.67,31.52 82.96,31.52 IC1.5 | v58.42,35.74 64.44,41.76 72.21,41.76 v74.45,43.99 | v80.09,44.27 81.38,44.27 U1.12
  Route15 0.305: IC1.5 78.74,28.57 78.41,28.25 78.41,28.19 77.86,27.64 77.8,27.64 68000.5
  Bottom 0.178: BLITTER.21 31.76,63.38 30.88,64.25 30.88,64.98 35.87,69.97 46.9,69.97 57.28,80.35 61.81,80.35 63.09,79.07 J4.6
  Bottom 0.203: IC1.5 80.01,33.38 77.65,35.74 v58.42,35.74 49.17,35.74 45.34,39.57 45.34,39.59 41.86,43.07 41.86,51.98 BLITTER.21 | v74.45,43.99 74.7,44.24 80.06,44.24 v80.09,44.27
D1  (via drill 0.35)
  Top 0.178: CFCARD.15 4.76,44.33 8.14,44.33 16.18,52.38 16.18,55.96 21.08,60.85 21.09,60.85 31.76,60.85 32.63,61.71 32.63,62.44 31.76,63.32 BLITTER.20
  Top 0.203: STGA.38 112.92,40 111.54,40 110.62,40.38 109.23,40.38 99.84,30.99 84.96,30.99 IC1.4 | v57.1,36.48 58.37,36.48 66.06,44.18 66.06,47.04 67.17,48.14 v70.94,48.14 | v83.39,51.33 U1.92
  Route15 0.305: IC1.4 81.28,28.57 80.95,28.25 80.95,28.19 80.4,27.64 80.34,27.64 68000.4
  Bottom 0.178: BLITTER.20 36.7,69.56 46.99,69.56 55.28,77.85 65.05,77.85 J4.8
  Bottom 0.203: 68000.4 77.47,24.79 79.25,26.57 80.19,26.57 81,27.38 81,33.03 77.55,36.48 v57.1,36.48 50.99,36.48 44.82,42.65 43.38,42.65 42.24,43.79 42.24,52.88 33,62.12 33,63.39 BLITTER.20 | v83.39,51.33 80.2,48.14 v70.94,48.14
D2
  Top 0.178: CFCARD.13 4.76,42.33 6.69,42.33 16.56,52.2 16.56,55.83 21.22,60.49 31.91,60.49 33.5,62.08 BLITTER.19
  Top 0.203: STGA.39 108.76,39.29 100,30.53 87,30.53 85.09,28.63 IC1.3
  Route15 0.305: IC1.3 83.82,28.57 83.49,28.25 83.49,28.19 82.94,27.64 82.88,27.64 68000.3
  Bottom 0.178: BLITTER.19 34.3,62.84 33.42,63.72 33.42,64.98 37.64,69.2 47.14,69.2 53.26,75.32 66.95,75.32 67.54,75.92 67.54,78.03 68.58,79.07 J4.10
  Bottom 0.203: 68000.3 80.01,25.41 81.59,26.99 81.59,33 77.21,37.38 52.63,37.38 46.98,43.03 43.67,43.03 42.67,44.02 42.67,53.7 BLITTER.19
D3
  Top 0.178: CFCARD.11 4.76,40.33 8.54,40.33 16.94,48.73 16.94,55.1 20.5,58.66 25.11,58.66 26.58,60.13 33.59,60.13 35.17,61.71 35.17,62.44 34.3,63.32 BLITTER.18
  Top 0.203: STGA.40 112.28,38.28 110.47,38.28 109.76,38.57 108.62,38.57 100.15,30.1 89.18,30.1 88.01,28.93 87.99,28.93 IC1.2
  Route15 0.305: IC1.2 86.36,28.57 86.03,28.25 86.03,28.19 85.48,27.64 85.42,27.64 68000.2
  Bottom 0.178: BLITTER.18 34.82,65.14 34.82,65.35 38.32,68.85 47.33,68.85 53.45,74.97 69.16,74.97 70.09,75.9 70.09,77.81 J4.12
  Bottom 0.203: 68000.2 82.55,26.67 83.46,27.59 83.46,31.77 77.45,37.79 52.76,37.79 47.14,43.41 43.98,43.41 43.05,44.33 43.05,54.6 34.3,63.36 BLITTER.18
D4
  Top 0.178: CFCARD.9 4.48,38.61 7.35,38.61 17.3,48.56 17.3,54.95 20.65,58.31 25.25,58.31 26.73,59.78 34.54,59.78 BLITTER.17
  Top 0.203: STGA.41 108.13,37.44 100.33,29.64 91.24,29.64 IC1.1
  Route15 0.305: IC1.1 88.9,28.57 88.57,28.25 88.57,28.19 88.02,27.64 87.51,27.64 85.75,25.88 85.75,25.43 68000.1
  Bottom 0.178: BLITTER.17 35.17,63.74 35.17,65.2 38.46,68.49 47.48,68.49 53.6,74.61 71.34,74.61 72.61,75.88 72.61,77.79 J4.14
  Bottom 0.203: 68000.1 85.09,26.55 84.08,27.56 84.08,31.72 77.6,38.2 53.61,38.2 47.88,43.92 47.88,44.95 47.26,45.57 44.2,45.57 43.43,46.33 43.43,55.48 BLITTER.17
D5  (via drill 0.35)
  Top 0.178: CFCARD.7 5.93,36.64 17.65,48.36 17.65,54.81 20.8,57.95 25.4,57.95 26.88,59.42 35.42,59.42 37.71,61.71 37.71,62.44 36.84,63.32 BLITTER.16
  Top 0.203: STGA.42 111.76,35.71 112.04,35.43 112.04,34.31 111.35,33.63 106.3,33.63 101.01,28.35 92.99,28.35 90.89,26.24 88.9,26.24 88.62,25.96 | IC1.64 90.17,6.63 87.85,8.95 87.86,21.79 87.86,25.2 88.62,25.96 | 88.62,25.96 v88.61,25.96
  Route15 0.305: IC1.64 88.9,5.72 88.57,5.38 88.57,5.33 87.95,4.7 86.76,4.7 86.64,4.59 85.99,4.22 85.97,4.17 85.92,4.14 85.85,3.88 85.72,3.56 85.54,3.38 85.54,2.35 68000.64
  Bottom 0.178: 46.15,67.41 47.96,67.41 54.09,73.54 80.96,73.54 83.15,75.73 83.15,79.87 82.32,80.7 78.05,80.7 J4.16
  Bottom 0.203: v88.61,25.96 88.61,34.45 80.08,42.98 54.89,42.98 52.08,45.79 52.08,61.49 46.15,67.41 39.69,67.41 36.89,64.62 BLITTER.16
D6  (via drill 0.35)
  Top 0.178: CFCARD.5 6.82,34.64 18.01,45.83 18.01,54.23 19.9,56.12 34.25,56.12 39.38,61.25 BLITTER.15
  Top 0.203: STGA.43 107.54,35.59 100.73,28.78 92.85,28.78 90.72,26.64 88.35,26.64 v87.53,25.83 86.94,25.24 86.94,6.4 IC1.63
  Route15 0.305: 68000.63 83.82,1.91 84.15,2.24 84.15,3.1 85.54,4.49 85.56,4.49 85.58,4.54 85.61,4.56 85.62,4.59 86.41,5.04 86.56,5.19 87.1,5.19 IC1.63
  Bottom 0.178: BLITTER.15 37.71,63.74 36.47,63.74 35.96,64.25 35.96,64.98 38.76,67.78 47.8,67.78 53.92,73.9 80.79,73.9 82.79,75.9 82.79,79.72 82.17,80.34 80.24,80.34 J4.18
  Bottom 0.203: v87.53,25.83 86.41,26.95 86.41,36.07 79.91,42.57 54.75,42.57 51.7,45.63 51.7,61.33 45.99,67.03 40.53,67.03 38.49,64.99 38.49,63.03 39.38,62.14 BLITTER.15
D7  (via drill 0.35)
  Top 0.178: BLITTER.14 40.99,63 40.99,60.93 35.83,55.77 20.1,55.77 18.38,54.04 18.38,45.67 5.34,32.64 CFCARD.3
  Top 0.203: STGA.44 110.87,34.95 110.87,35.99 108.95,36.79 107.38,36.14 100.42,29.19 92.68,29.19 90.55,27.05 87.86,27.05 v86.41,25.6 86.41,8.08 85.09,6.76 IC1.62
  Route15 0.305: 68000.62 81.28,1.91 81.61,2.24 81.61,2.29 82.16,2.84 82.22,2.84 IC1.62
  Bottom 0.178: BLITTER.14 39.38,63.32 40.25,62.44 40.25,61.71 39.74,61.2 39.01,61.2 37.03,63.18 36.23,63.18 35.53,63.89 35.53,65.05 38.61,68.13 47.63,68.13 53.75,74.26 78.63,74.26 80.25,75.88 80.25,77.81 J4.20
  Bottom 0.203: v86.41,25.6 86,26.01 86,35.93 79.77,42.16 54.62,42.16 51.31,45.47 51.31,61.17 45.84,66.65 41.41,66.65 BLITTER.14
D8  (via drill 0.35)
  Top 0.178: CFCARD.4 2.54,32.64 3.48,31.7 4.95,31.7 18.73,45.48 18.73,53.89 20.25,55.41 35.97,55.41 41.92,61.35 BLITTER.13
  Top 0.203: IC1.61 82.55,6.93 71.35,18.14 71.35,29.57 74.68,32.89 v84.18,32.89 99.32,32.89 108.16,41.74 119.37,65.73 120.06,66.42 120.9,66.42 122.33,65.82 123.59,65.82 STGA.10
  Route15 0.305: 68000.61 78.74,1.91 79.07,2.24 79.07,2.29 79.62,2.84 79.68,2.84 IC1.61
  Bottom 0.203: v84.18,32.89 v84.17,32.9 84.17,37.21 79.62,41.76 54.49,41.76 50.93,45.31 50.93,61.01 45.68,66.27 42.31,66.27 41.03,64.99 41.03,62.9 41.85,62.08 BLITTER.13
D9  (via drill 0.35)
  Top 0.178: CFCARD.6 3.5,35.69 v6.02,35.69 | BLITTER.12 41,65.53 23.42,65.53 10.24,52.34 10.24,49.89 9.14,48.79 v9.14,47.27
  Top 0.203: IC1.60 80.01,6.93 70.89,16.05 70.89,29.76 74.64,33.5 v83.49,33.5 99.35,33.5 107.76,41.91 119.1,66.32 119.78,67 STGA.9
  Route15 0.305: 68000.60 76.2,1.91 76.53,2.24 76.53,2.29 77.08,2.84 77.14,2.84 IC1.60
  Bottom 0.178: v9.14,47.27 9.14,38.81 v6.02,35.69
  Bottom 0.203: v83.49,33.5 83.49,37.34 79.51,41.33 54.38,41.33 50.55,45.16 50.55,60.86 45.52,65.89 43.19,65.89 BLITTER.12
D10  (via drill 0.35)
  Top 0.178: CFCARD.8 3.48,37.67 v6.07,37.67 | BLITTER.11 43.5,63.03 43.5,65.27 42.18,66.6 22.98,66.6 8.46,52.07 v8.46,51.03
  Top 0.203: IC1.59 77.47,6.93 68.81,15.6 68.81,29.46 73.47,34.11 v82.86,34.11 99.39,34.11 107.47,42.19 118.41,66.19 118.47,66.33 120.17,68.03 122.4,68.03 123.05,67.77 124.45,67.77 STGA.8
  Route15 0.305: 68000.59 73.66,1.91 73.99,2.24 73.99,2.29 74.54,2.84 74.6,2.84 IC1.59
  Bottom 0.178: v6.07,37.67 8.46,40.06 v8.46,51.03
  Bottom 0.203: v82.86,34.11 v82.85,34.12 82.85,37.43 79.42,40.87 54.3,40.87 50.17,45 50.17,60.7 45.36,65.51 44.09,65.51 43.54,64.96 43.54,62.98 44.44,62.08 BLITTER.11
D11  (via drill 0.35)
  Top 0.178: CFCARD.10 3.4,39.58 6.03,39.58 v6.04,39.6 | BLITTER.10 43.86,65.21 43.86,65.42 42.33,66.95 22.83,66.95 7.8,51.91 v7.8,50.24 v7.79,50.24
  Top 0.203: IC1.58 74.93,6.93 68.35,13.51 68.35,29.63 73.53,34.8 v82.17,34.8 82.35,34.8 82.36,34.79 99.49,34.79 106.86,42.16 118.27,66.98 120.15,68.85 STGA.7
  Route15 0.305: 68000.58 71.12,1.91 71.45,2.24 71.45,2.29 72,2.84 72.06,2.84 IC1.58
  Bottom 0.178: v6.04,39.6 6.22,39.6 7.82,41.2 7.82,50.21 v7.79,50.24
  Bottom 0.203: v82.17,34.8 82.14,34.83 82.14,37.57 79.25,40.46 54.17,40.46 49.79,44.84 49.79,60.54 45.71,64.62 BLITTER.10
D12  (via drill 0.35)
  Top 0.178: BLITTER.9 45.69,63.39 45.69,65.13 43.15,67.66 22.43,67.66 5.97,51.2 v5.97,49.71 | CFCARD.12 3.12,40.64 4.06,41.58 4.84,41.58 4.85,41.58 v5.97,41.58
  Top 0.203: IC1.57 67.89,10.21 67.89,22.07 66.4,23.57 66.4,29.56 72.33,35.5 v81.46,35.5 81.49,35.54 99.66,35.54 106.38,42.25 117.94,67.35 120.39,69.81 123.35,69.81 123.69,69.67 125.27,69.67 STGA.6
  Route15 0.305: 68000.57 68.58,1.91 68.91,2.24 68.91,2.29 69.46,2.84 69.52,2.84 IC1.57
  Bottom 0.178: v5.97,41.58 v5.97,49.71
  Bottom 0.203: v81.46,35.5 81.46,37.68 79.13,40.01 54.09,40.01 49.41,44.68 49.41,59.66 BLITTER.9
D13  (via drill 0.35)
  Top 0.178: CFCARD.14 3.5,43.69 7.14,43.69 v7.19,43.74 | BLITTER.8 43.15,60.85 43.15,65.13 42.04,66.24 23.13,66.24 9.25,52.36 9.25,50.49 7.21,48.46 v7.19,48.46
  Top 0.203: IC1.56 67.46,8.1 67.46,21.69 65.86,23.29 65.86,29.68 72.41,36.22 v80.82,36.22 99.77,36.22 105.74,42.19 117.43,67.52 120.61,70.7 STGA.5
  Route15 0.305: 68000.56 66.04,1.91 66.37,2.24 66.37,2.29 66.92,2.84 66.98,2.84 IC1.56
  Bottom 0.178: v7.19,48.46 v7.19,43.74
  Bottom 0.203: v80.82,36.22 80.82,37.74 78.96,39.6 53.95,39.6 49.03,44.52 49.03,59.02 47.62,60.43 45.31,60.43 44.46,59.58 BLITTER.8
D14  (via drill 0.35)
  Top 0.178: CFCARD.16 3.41,45.59 v6.58,45.59 | BLITTER.7 45.33,61.2 45.33,64.98 43.01,67.31 22.58,67.31 6.57,51.3 v6.57,49.13
  Top 0.203: IC1.55 67.31,6.93 66.94,7.3 66.94,20.73 63.75,23.91 63.75,29.59 71.07,36.91 v80.11,36.91 99.88,36.91 105.11,42.14 117.01,67.74 120.93,71.65 124.12,71.65 124.46,71.51 126.04,71.51 STGA.4
  Route15 0.305: 68000.55 63.5,1.91 63.83,2.24 63.83,2.29 64.38,2.84 64.44,2.84 IC1.55
  Bottom 0.178: v6.57,49.13 v6.58,49.12 v6.58,45.59
  Bottom 0.203: v80.11,36.91 80.11,37.67 78.62,39.17 53.85,39.17 48.65,44.37 48.65,57.89 BLITTER.7
D15  (via drill 0.35)
  Top 0.178: CFCARD.18 3.42,47.6 7.26,47.6 9.78,50.12 9.78,52.39 23.27,65.88 41.89,65.88 42.79,64.98 42.79,58.66 BLITTER.6
  Top 0.203: STGA.3 121.2,72.55 116.54,67.89 104.81,42.41 99.94,37.54 79.43,37.54 v79.4,37.51 71.03,37.51 63.27,29.75 63.27,23.68 66.55,20.4 66.55,7.49 IC1.54
  Route15 0.305: 68000.54 60.96,1.91 61.29,2.24 61.29,2.29 61.84,2.84 61.9,2.84 IC1.54
  Bottom 0.203: v79.4,37.51 78.23,38.68 53.75,38.68 48.27,44.16 48.27,54.45 45.71,57 BLITTER.6
DASP
  Bottom 0.203: CFCARD.39 4.45,69.29 3.5,70.24 3.5,71.03 4.06,71.59 4.85,71.59 5.41,71.03 R5.1
DMACK
  Bottom 0.203: R6.2 6.88,65.65 6.24,65 6.24,60.42 CFCARD.29
DTACK  (via drill 0.35)
  Top 0.203: v58.8,32 67.69,40.89 82.96,40.89 U1.19
  Route15 0.305: IC1.10 66.04,28.57 65.71,28.25 65.71,28.19 65.16,27.64 65.1,27.64 68000.10
  Bottom 0.203: IC1.10 67.31,28.66 64.05,31.92 58.72,31.92 | 58.72,31.92 v58.8,32 | BLITTER.27 22.87,60.81 24.78,60.81 37.72,47.86 37.72,38.53 44.34,31.92 58.72,31.92
E
  Route15 0.305: IC1.20 40.64,28.57 40.31,28.25 40.31,28.19 39.76,27.64 39.7,27.64 68000.20
ET_EN  (via drill 0.35)
  Top 0.178: v73.43,55.44 74.34,54.53 79.47,54.53 U1.93
  Top 0.61: SJ7.2 73.45,55.46 v73.43,55.44
  Bottom 0.61: R9.2 73.43,54.66 v73.43,55.44
ET_IORD  (via drill 0.35)
  Top 0.203: U1.64 98.61,61.49 112.2,61.49 113.15,62.44 v113.16,62.43
  Bottom 0.203: STGA.15 118.9,62.43 v113.16,62.43
ET_IOWR  (via drill 0.35)
  Top 0.203: U1.67 97.27,62.28 111.55,62.28 113.51,64.24 v114,64.24
  Bottom 0.203: STGA.14 121.63,63.39 121.36,64.04 120.72,64.31 120.7,64.32 114.08,64.32 v114,64.24
ET_IRQ
  Top 0.203: U1.75 89.46,60.12 92.59,60.12 96.29,63.83 110.72,63.83 121.28,74.39 STGA.1
ET_MEMRD  (via drill 0.35)
  Top 0.203: U1.65 98.31,61.9 111.73,61.9 113.18,63.35 v113.59,63.35
  Bottom 0.203: STGA.13 113.63,63.31 v113.59,63.35
ET_MEMWR  (via drill 0.35)
  Top 0.203: U1.69 96.65,63.07 111.24,63.07 114.34,66.17 v114.88,66.17
  Bottom 0.203: STGA.12 122.39,65.24 122.13,65.89 121.48,66.15 121.47,66.17 v114.89,66.17 v114.88,66.17
ET_RDY  (via drill 0.35)
  Top 0.203: U1.68 96.95,62.66 111.37,62.66 113.93,65.22 v114.48,65.22
  Bottom 0.203: v114.48,65.22 114.6,65.11 121.35,65.11 STGA.11
ET_VRES
  Top 0.203: U1.71 90.22,58.03 91.35,59.16 92.2,59.16 96.49,63.45 111.03,63.45 121.13,73.55 124.76,73.55 125.22,73.36 126.8,73.36 STGA.2
FC0
  Top 0.203: 68000.28 14.58,26.7 10.62,26.7 9.91,27.41 9.91,29.7 19.98,39.78 22.18,39.78 24.14,41.73 BLITTER.45
  Route15 0.305: IC1.28 20.32,28.57 19.99,28.25 19.99,28.19 19.44,27.64 19.38,27.64 68000.28
FC1
  Top 0.203: 68000.27 16.74,27.08 10.99,27.08 10.36,27.7 10.36,29.45 20.16,39.24 24.11,39.24 BLITTER.44
  Route15 0.305: IC1.27 22.86,28.57 22.53,28.25 22.53,28.19 21.98,27.64 21.92,27.64 68000.27
FC2
  Top 0.203: IC1.26 27.33,28.57 35.26,36.51 35.26,39.79 34.61,40.44 33.76,40.44 33.07,41.12 33.07,42.47 32.13,43.41 25.96,43.41 25.66,43.1 22.94,43.1 BLITTER.43
  Route15 0.305: IC1.26 25.4,28.57 25.07,28.25 25.07,28.19 24.52,27.64 24.46,27.64 68000.26
GND  (via drill 0.35)
  Top 0.305: C4.2 52.07,17.58 v48.62,21.03 | U1.86 82.11,56.84 v81.76,56.84 | U1.95 80.78,51.82 v80.8,51.82 | U1.11 82.56,46.15 v82.58,46.15 | U1.26 88.81,40.28 89.71,39.37 v89.74,39.37 | U1.38 92.28,45.26 v91.34,45.26 | U1.43 94.79,46.32 93.89,47.22 v92.33,47.22 | U1.59 95.36,54.71 v95.43,54.71 | U1.74 88.16,58.12 v87.66,58.12 | C2.2 51.56,50 51.59,50.03 52.72,50.03 v52.73,50.04
  Top 0.61: v62.15,57.83 SJ3.1 SJ4.1 68.35,57.83 SJ5.1 SJ6.1 SJ7.1 v74.67,57.85
  Route15 0.305: 68000.53 58.42,1.91 58.75,2.24 58.75,2.29 59.3,2.84 59.36,2.84 IC1.53 | IC1.16 50.8,28.57 50.47,28.25 50.47,28.19 49.92,27.64 49.86,27.64 68000.16
  Bottom 0.305: 68000.16 47.01,24.74 47.01,23.69 C3.2 48.3,21.35 v48.62,21.03 | C5.1 87.62,58.08 v87.66,58.12 | C7.1 95.43,54.61 v95.43,54.71 | v88.88,48.77 88.88,48.72 C8.1 89.02,47.56 89.02,46.44 C9.1 87.83,46.56 v87.83,46.58 | v82.58,46.15 82.89,45.83 C10.1 | v81.76,56.84 81.28,56.84 C12.1 | v80.8,51.82 81.47,51.14 C11.1 | v89.51,52.43 89.51,52.48 C6.1 | BLITTER.35 19.93,51.92 C1.2
  pour Route2: -6.76,84.63 140.77,84.63 140.77,-5.59 -6.76,-5.59
HALT
  Route15 0.305: IC1.17 48.26,28.57 47.93,28.25 47.93,28.19 47.38,27.64 47.32,27.64 68000.17
IDE_ADDR0  (via drill 0.35)
  Top 0.178: U1.98 77.45,53.02 65.58,53.02 65.58,53.08 v63.24,55.41
  Top 0.61: SJ3.2 63.29,55.46 v63.24,55.41
  Bottom 0.61: R3.2 63.24,54.66 v63.24,55.41
IDE_ADDR1  (via drill 0.35)
  Top 0.178: v65.84,55.44 67.87,53.41 77.77,53.41 U1.97
  Top 0.61: SJ4.2 v65.84,55.44
  Bottom 0.61: v65.84,55.44 65.84,54.66 R4.2
IDE_CS0
  Top 0.203: U1.100 76.8,52.25 63.6,52.25 44.67,71.18 20.31,71.18 16.36,67.23 5.05,67.23 CFCARD.37
IDE_CS1
  Top 0.203: U1.99 77.11,52.66 63.8,52.66 44.89,71.56 20.15,71.56 16.25,67.66 3.48,67.66 CFCARD.38
IDE_EN  (via drill 0.35)
  Top 0.178: v68.38,55.49 70.1,53.76 78.11,53.76 79.5,52.37 U1.96
  Top 0.61: SJ5.2 v68.38,55.49
  Bottom 0.61: R7.2 68.38,54.64 v68.38,55.49
IDE_IRQ
  Top 0.203: U1.6 79.26,46.39 77.28,46.39 71.81,51.86 63.43,51.86 44.49,70.8 20.46,70.8 10.3,60.64 CFCARD.31
IDE_RD
  Top 0.203: U1.9 80.3,45.3 77.22,45.3 71.45,51.07 63.06,51.07 44.12,70.01 20.75,70.01 5.38,54.64 CFCARD.25
IDE_RDY
  Top 0.203: U1.8 80.57,46.26 80,45.68 77.42,45.68 71.65,51.46 63.27,51.46 44.33,70.39 20.6,70.39 6.84,56.64 CFCARD.27
IDE_WR
  Top 0.203: U1.10 80.62,44.92 77.03,44.92 71.28,50.68 62.9,50.68 43.94,69.63 20.91,69.63 4.45,53.17 CFCARD.23
IO76
  Top 0.203: J4.19 81.51,64.52 U1.76
IO79
  Top 0.203: U1.79 85.52,58.41 78.97,64.96 J4.17
IO80
  Top 0.203: J4.15 76.43,66.77 U1.80
IO81
  Top 0.203: J4.13 73.89,68.6 U1.81
IO83
  Top 0.203: J4.11 71.35,69.73 U1.83
IO84
  Top 0.203: J4.9 68.81,71.56 U1.84
IO85
  Top 0.203: J4.7 66.27,73.39 U1.85
IPL0
  Route15 0.305: IC1.25 27.94,28.57 27.61,28.25 27.61,28.19 27.06,27.64 27,27.64 68000.25
IPL1
  Route15 0.305: IC1.24 30.48,28.57 30.15,28.25 30.15,28.19 29.6,27.64 29.54,27.64 68000.24
IPL2
  Route15 0.305: IC1.23 33.02,28.57 32.69,28.25 32.69,28.19 32.14,27.64 32.08,27.64 68000.23
LDS  (via drill 0.35)
  Top 0.203: STGA.36 113.76,41.92 112.21,41.92 111.5,42.22 109.79,42.22 99.48,31.9 81.37,31.9 78.83,29.36 78.83,27.6 78.11,26.87 73.18,26.87 72.39,27.66 IC1.8 | v62.51,33.36 62.51,33.4 69.12,40.02 83.49,40.02 U1.21
  Route15 0.305: IC1.8 71.12,28.57 70.79,28.25 70.79,28.19 70.24,27.64 70.18,27.64 68000.8
  Bottom 0.203: IC1.8 67.6,33.36 v62.51,33.36 43.98,33.36 38.49,38.85 38.49,50.3 26.71,62.08 BLITTER.25
N$14
  Bottom 0.203: R5.2 7.15,73.2 LED1.K
RCEI  (via drill 0.35)
  Top 0.178: 14.76,61.71 v14.76,61.39
  Top 0.203: U1.16 81.98,42.04 78.27,42.04 70.81,49.5 62.33,49.5 43.47,68.36 21.41,68.36 14.76,61.71
  Bottom 0.203: v14.76,61.39 14.76,38 4.34,27.58 4.34,19.41 2.59,17.65 J1.6
RCEO  (via drill 0.35)
  Top 0.203: U1.14 82.7,44.14 81.84,43.28 77.6,43.28 70.98,49.9 62.5,49.9 43.52,68.87 21.24,68.87 14.07,61.7 v14.07,60.73
  Bottom 0.203: J1.7 2.59,20.24 3.86,21.51 3.86,27.74 14.07,37.95 v14.07,60.73
RESET  (via drill 0.35)
  Top 0.178: v9.45,26.61 7.59,26.61 4.45,29.75 CFCARD.1
  Top 0.203: U1.17 81.98,41.33 66.33,41.33 56.6,31.6 55.43,30.44 v55.37,30.44
  Route15 0.305: IC1.18 45.72,28.57 45.39,28.25 45.39,28.19 44.84,27.64 44.78,27.64 68000.18
  Bottom 0.178: 68000.18 40.42,26.25 9.81,26.25 v9.45,26.61 | 33.41,41.76 33.41,44.11 30.25,47.27 26.25,47.27 BLITTER.38
  Bottom 0.203: v55.37,30.44 55.31,30.38 48.83,30.38 47.03,28.57 IC1.18 46.99,29.72 46.16,30.54 41.71,30.54 33.41,38.85 33.41,41.76
ROM_EN  (via drill 0.35)
  Top 0.178: v70.92,55.49 72.28,54.13 79.26,54.13 80.22,53.16 U1.94
  Top 0.61: SJ6.2 v70.92,55.49
  Bottom 0.61: v70.92,55.49 70.92,54.66 R8.2
RW  (via drill 0.35)
  Top 0.203: v60.86,32.66 68.67,40.47 83.24,40.47 U1.20
  Route15 0.305: IC1.9 68.58,28.57 68.25,28.25 68.25,28.19 67.7,27.64 67.64,27.64 68000.9
  Bottom 0.203: IC1.9 69.85,28.65 65.89,32.61 60.91,32.61 v60.86,32.66 44.13,32.66 38.11,38.69 38.11,49.39 25.48,62.01 25.48,63.55 24.42,64.62 BLITTER.26
TCK  (via drill 0.35)
  Top 0.203: U1.62 91.74,53.21 87.02,53.21 v86.97,53.16
  Bottom 0.203: JTAG.4 65.99,46.38 80.19,46.38 v86.97,53.16
TDI  (via drill 0.35)
  Top 0.203: U1.4 78.5,47.04 77.63,47.04 v77.17,47.51
  Bottom 0.203: v77.17,47.51 62.03,47.51 JTAG.2
TDO  (via drill 0.35)
  Top 0.203: U1.73 88.52,57.77 88.52,55.6 v87.22,54.3
  Bottom 0.203: v87.22,54.3 79.78,46.86 63.91,46.86 62.23,45.19 JTAG.3
TMS  (via drill 0.35)
  Top 0.203: U1.15 81.91,42.67 v81.71,42.67
  Bottom 0.203: v81.71,42.67 81.2,42.67 80.49,43.38 58.93,43.38 JTAG.1
UDS  (via drill 0.35)
  Top 0.203: STGA.35 109.97,42.98 99.28,32.28 78.05,32.28 74.93,29.16 IC1.7 | v64.34,34.28 64.34,34.36 69.57,39.59 84.48,39.59 U1.23
  Route15 0.305: IC1.7 73.66,28.57 73.33,28.25 73.33,28.19 72.78,27.64 72.72,27.64 68000.7
  Bottom 0.203: IC1.7 74.89,28.57 69.19,34.28 v64.34,34.28 45.6,34.28 40.59,39.29 40.59,49.45 28.33,61.71 28.33,62.97 BLITTER.24
VMA
  Route15 0.305: IC1.19 43.18,28.57 42.85,28.25 42.85,28.19 42.3,27.64 42.24,27.64 68000.19
VPA
  Route15 0.305: IC1.21 38.1,28.57 37.77,28.25 37.77,28.19 37.22,27.64 37.16,27.64 68000.21

## Text on the board
tPlace: +5V | GND | D0 | D1 | D2 | D3 | D4 | D5 | D6 | D7 | STBlitter Rev.C | www.happydaze.se | Exp | CLK | IO85 | IO84 | IO83 | IO81 | IO80 | IO79 | IO76 | Blitter, IDE, ET4000, TOS decode | (c) 2020 Anders Granlund | DISABLE | IDE / ADDRESS | IDE | ROM | ET | here be pixels! | Sparkles | Brains | bits and bytes | GND | +5V | ACSI | Central Processing Unit | RCEO | OFF | ON | RCEI | BIRQ | OFF | A19 | ON | A18 | Blitter / Enable | A17 | A16